# Altium schematic sheet 10 CONNECTOR.SchDoc: Connector
size 420 x 297 mm; SheetNumber: 9; SheetTotal: 10
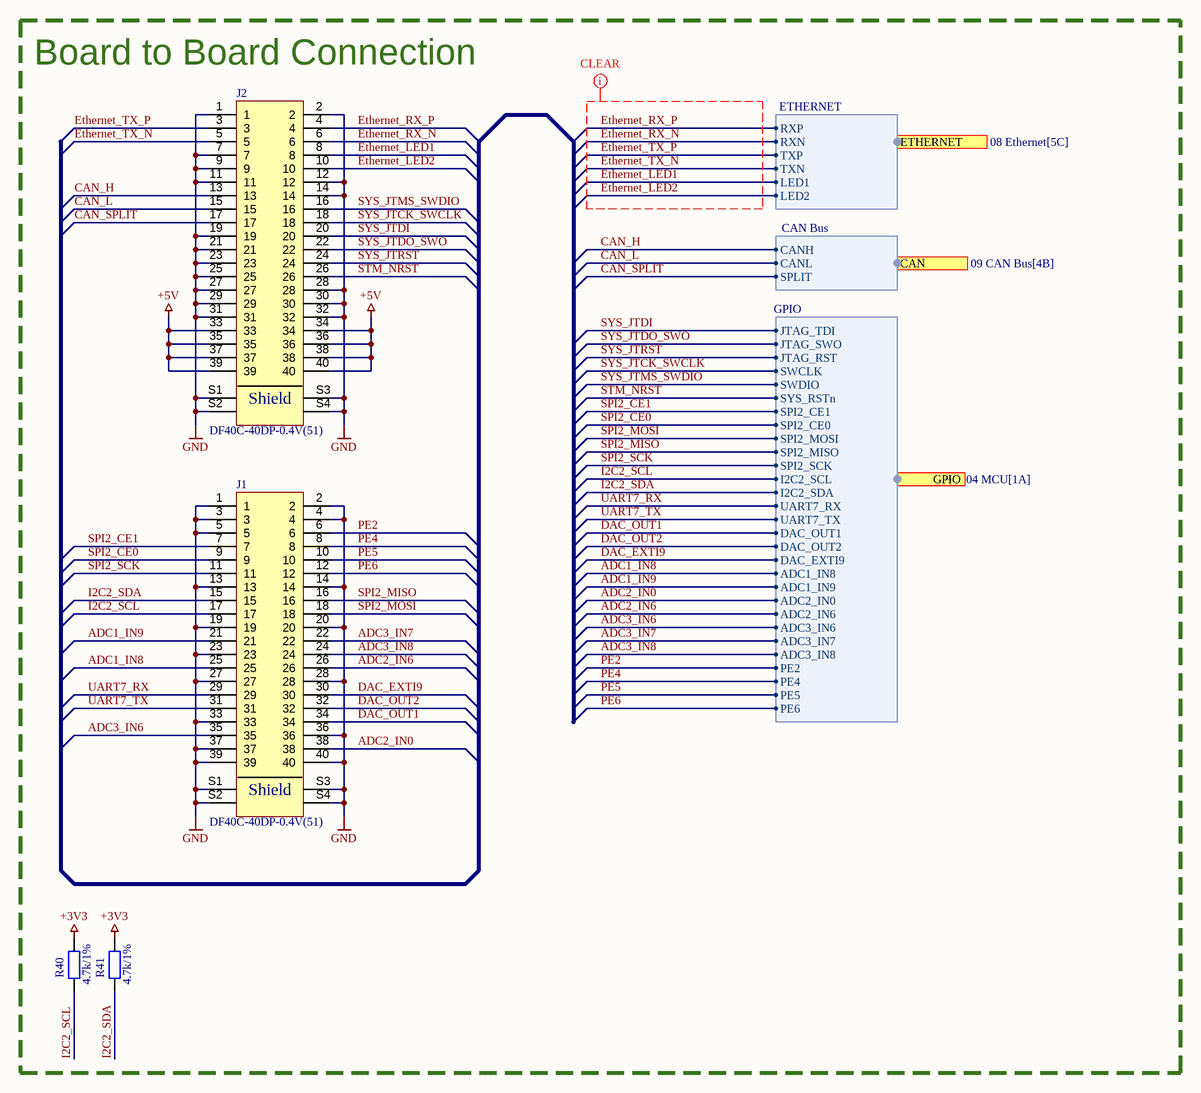
[diagram p0: 10 CONNECTOR.SchDoc]

## Parts
J1  DF40C-40DP-0.4V(51)  [DF40C-40DP-0.4V(51)]
J2  DF40C-40DP-0.4V(51)  [DF40C-40DP-0.4V(51)]
R40  4.7k/1%  [RESC1005X04M-0402]
R41  4.7k/1%  [RESC1005X04M-0402]

## Blocks framed on the sheet
Board to Board Connection: J1 J2 R40 R41

## Ports
CAN (harness CAN Bus, see 09 CAN Bus[4B]), ETHERNET (harness ETHERNET, see 08 Ethernet[5C]), GPIO (harness GPIO, see 04 MCU[1A])

## Harnesses
CAN Bus: CANH, CANL, SPLIT
ETHERNET: RXP, RXN, TXP, TXN, LED1, LED2
GPIO: JTAG_TDI, JTAG_SWO, JTAG_RST, SWCLK, SWDIO, SYS_RSTn, SPI2_CE1, SPI2_CE0, SPI2_MOSI, SPI2_MISO, SPI2_SCK, I2C2_SCL, I2C2_SDA, UART7_RX, UART7_TX, DAC_OUT1, DAC_OUT2, DAC_EXTI9, ADC1_IN8, ADC1_IN9, ADC2_IN0, ADC2_IN6, ADC3_IN6, ADC3_IN7, ADC3_IN8, PE2, PE4, PE5, PE6

## Nets
+3V3: R40.2 R41.2
+5V: J2.33 J2.34 J2.35 J2.36 J2.37 J2.38 J2.39 J2.40
GND: J1.1 J1.2 J1.3 J1.4 J1.5 J1.13 J1.14 J1.19 J1.20 J1.23 J1.27 J1.28 J1.33 J1.36 J1.37 J1.39 J1.40 J1.S1 J1.S2 J1.S3 J1.S4 J2.1 J2.2 J2.7 J2.9 J2.11 J2.12 J2.14 J2.19 J2.21 J2.23 J2.25 J2.27 J2.28 J2.29 J2.30 J2.31 J2.32 J2.S1 J2.S2 J2.S3 J2.S4
ADC1_IN8: J1.25 ; port GPIO.ADC1_IN8
ADC1_IN9: J1.21 ; port GPIO.ADC1_IN9
ADC2_IN0: J1.38 ; port GPIO.ADC2_IN0
ADC2_IN6: J1.26 ; port GPIO.ADC2_IN6
ADC3_IN6: J1.35 ; port GPIO.ADC3_IN6
ADC3_IN7: J1.22 ; port GPIO.ADC3_IN7
ADC3_IN8: J1.24 ; port GPIO.ADC3_IN8
CAN_H: J2.13 ; port CAN.CANH
CAN_L: J2.15 ; port CAN.CANL
CAN_SPLIT: J2.17 ; port CAN.SPLIT
DAC_EXTI9: J1.30 ; port GPIO.DAC_EXTI9
DAC_OUT1: J1.34 ; port GPIO.DAC_OUT1
DAC_OUT2: J1.32 ; port GPIO.DAC_OUT2
Ethernet_LED1: J2.8 ; port ETHERNET.LED1
Ethernet_LED2: J2.10 ; port ETHERNET.LED2
Ethernet_RX_N: J2.6 ; port ETHERNET.RXN
Ethernet_RX_P: J2.4 ; port ETHERNET.RXP
Ethernet_TX_N: J2.5 ; port ETHERNET.TXN
Ethernet_TX_P: J2.3 ; port ETHERNET.TXP
I2C2_SCL: J1.17 R40.1 ; port GPIO.I2C2_SCL
I2C2_SDA: J1.15 R41.1 ; port GPIO.I2C2_SDA
PE2: J1.6 ; port GPIO.PE2
PE4: J1.8 ; port GPIO.PE4
PE5: J1.10 ; port GPIO.PE5
PE6: J1.12 ; port GPIO.PE6
SPI2_CE0: J1.9 ; port GPIO.SPI2_CE0
SPI2_CE1: J1.7 ; port GPIO.SPI2_CE1
SPI2_MISO: J1.16 ; port GPIO.SPI2_MISO
SPI2_MOSI: J1.18 ; port GPIO.SPI2_MOSI
SPI2_SCK: J1.11 ; port GPIO.SPI2_SCK
STM_NRST: J2.26 ; port GPIO.SYS_RSTn
SYS_JTCK_SWCLK: J2.18 ; port GPIO.SWCLK
SYS_JTDI: J2.20 ; port GPIO.JTAG_TDI
SYS_JTDO_SWO: J2.22 ; port GPIO.JTAG_SWO
SYS_JTMS_SWDIO: J2.16 ; port GPIO.SWDIO
SYS_JTRST: J2.24 ; port GPIO.JTAG_RST
UART7_RX: J1.29 ; port GPIO.UART7_RX
UART7_TX: J1.31 ; port GPIO.UART7_TX

## Layout directives
net class CLEAR: Ethernet_LED1, Ethernet_LED2, Ethernet_RX_N, Ethernet_RX_P, Ethernet_TX_N, Ethernet_TX_P

## Notes on the sheet
- Title
- Project
- Size
- Date
- Revision
- A3
- Designed By
- (in symbol DF40C-40DP-0.4V(51)) Shield

## Library data of the parts
J1 J2 = DF40C-40DP-0.4V(51): 40 Position Connector Plug, Outer Shroud Contacts Surface Mount Gold; MPN: DF40C-40DP-0.4V(51); ComponentLink1Description: Datasheet; ComponentLink1URL: https://www.hirose.com/en/product/document?clcode=&productname=&series=DF40&documenttype=Catalog&lang=en&documentid=en_DF40_CAT
R40 R41 = RC0402FR-074K7L: 4.7 kOhms ±1% 0.063W, 1/16W Chip Resistor 0402 (1005 Metric) Moisture Resistant Thick Film; ComponentLink1Description: Datasheet; ComponentLink1URL: https://www.yageo.com/upload/media/product/productsearch/datasheet/rchip/PYu-RC_Group_51_RoHS_L_12.pdf; MPN: RC0402FR-074K7L